# EAGLE design jusin_boad (EAGLE 6.2)
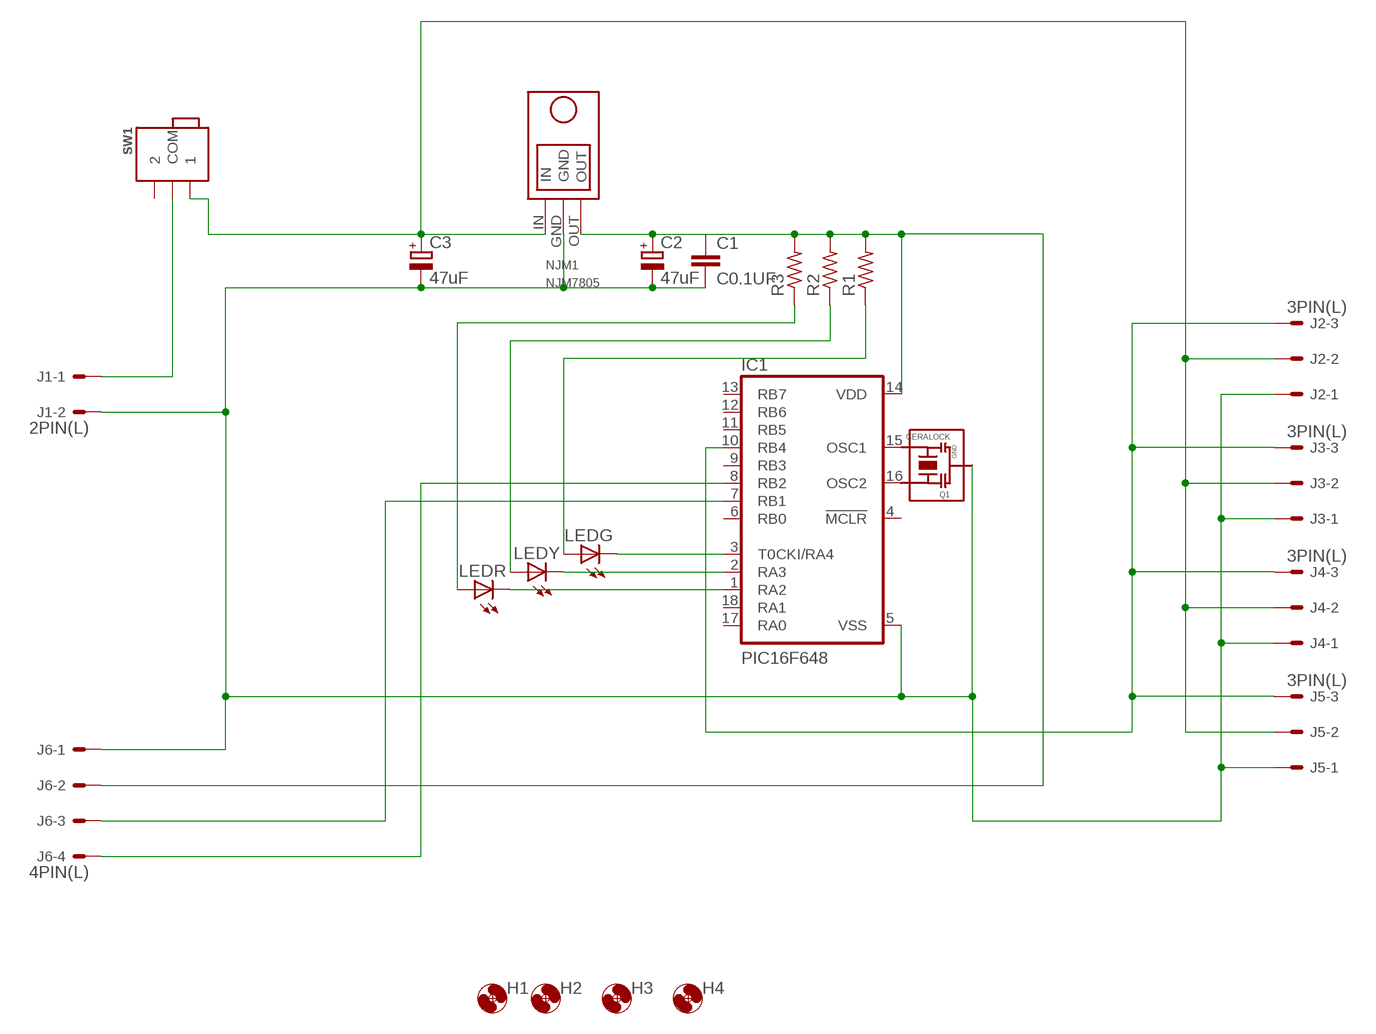
[diagram p0: schematic, sheet 1]

## Parts
C1  C0.1UF  [C0.1UF]
C2  47uF  C-ELEC  [C-6MM]
C3  47uF  C-ELEC  [C-6MM]
H1  HOLE3.3M3BOLT  [HOLE3.3]
H2  HOLE3.3M3BOLT  [HOLE3.3]
H3  HOLE3.3M3BOLT  [HOLE3.3]
H4  HOLE3.3M3BOLT  [HOLE3.3]
IC1  PIC16F648  [DIL18]
J1  2PIN(L)  [2PL]
J2  3PIN(L)  [3PL]
J3  3PIN(L)  [3PL]
J4  3PIN(L)  [3PL]
J5  3PIN(L)  [3PL]
J6  4PIN(L)  [4PL]
LEDG  LED  [LED5MM]
LEDR  LED  [LED5MM]
LEDY  LED  [LED5MM]
NJM1  NJM7805  [NJM7805]
Q1  CERALOCK  [CERALOCK]
R1  R-  [0207/10]
R2  R-  [0207/10]
R3  R-  [0207/10]
SW1  SWITCH_MININORMAL  [SWITCH_MINI]

## Nets
N$1: IC1.16(OSC2) Q1.P$1
N$2: IC1.15(OSC1) Q1.P$3
N$3: J1.1 SW1.COM
N$4: C3.+ J2.2 J3.2 J4.2 J5.2 NJM1.IN SW1.1
N$5: C1.2 C2.- C3.- IC1.5(VSS) J1.2 J2.1 J3.1 J4.1 J5.1 J6.1 NJM1.GND Q1.P$2
N$6: C1.1 C2.+ IC1.14(VDD) J6.2 NJM1.OUT R1.2 R2.2 R3.2
N$7: IC1.10(RB4) J2.3 J3.3 J4.3 J5.3
N$8: LEDR.A R3.1
N$9: LEDG.A R1.1
N$10: LEDY.A R2.1
N$11: IC1.3(T0CKI/RA4) LEDG.K(C)
N$12: IC1.2(RA3) LEDY.K(C)
N$13: IC1.1(RA2) LEDR.K(C)
N$15: IC1.7(RB1) J6.3
N$16: IC1.8(RB2) J6.4
Unconnected: IC1.4(!MCLR) IC1.6(RB0) IC1.9(RB3) IC1.11(RB5) IC1.12(RB6) IC1.13(RB7) IC1.17(RA0) IC1.18(RA1) SW1.2

## Library data of the parts
C1 = FP-21T for MITS:C0.1UF
C2 C3 = My_rcl:C-ELEC
H1-H4 = FP-21T for MITS:HOLE3.3
IC1 = FP-21T for MITS:PIC16F648
J1 = my_connector:2PIN(L)
J2-J5 = my_connector:3PIN(L)
J6 = my_connector:4PIN(L)
LEDG LEDR LEDY = my_led:LED: LED
NJM1 = My_NJM7805:NJM7805
Q1 = FP-21T for MITS:CERALOCK: CERALOCK CERAMIC RESONATOR
R1-R3 = My_rcl:R-: Resistor
SW1 = FP-21T for MITS:SWITCH_MINI: Switch 5.08mm

## Board
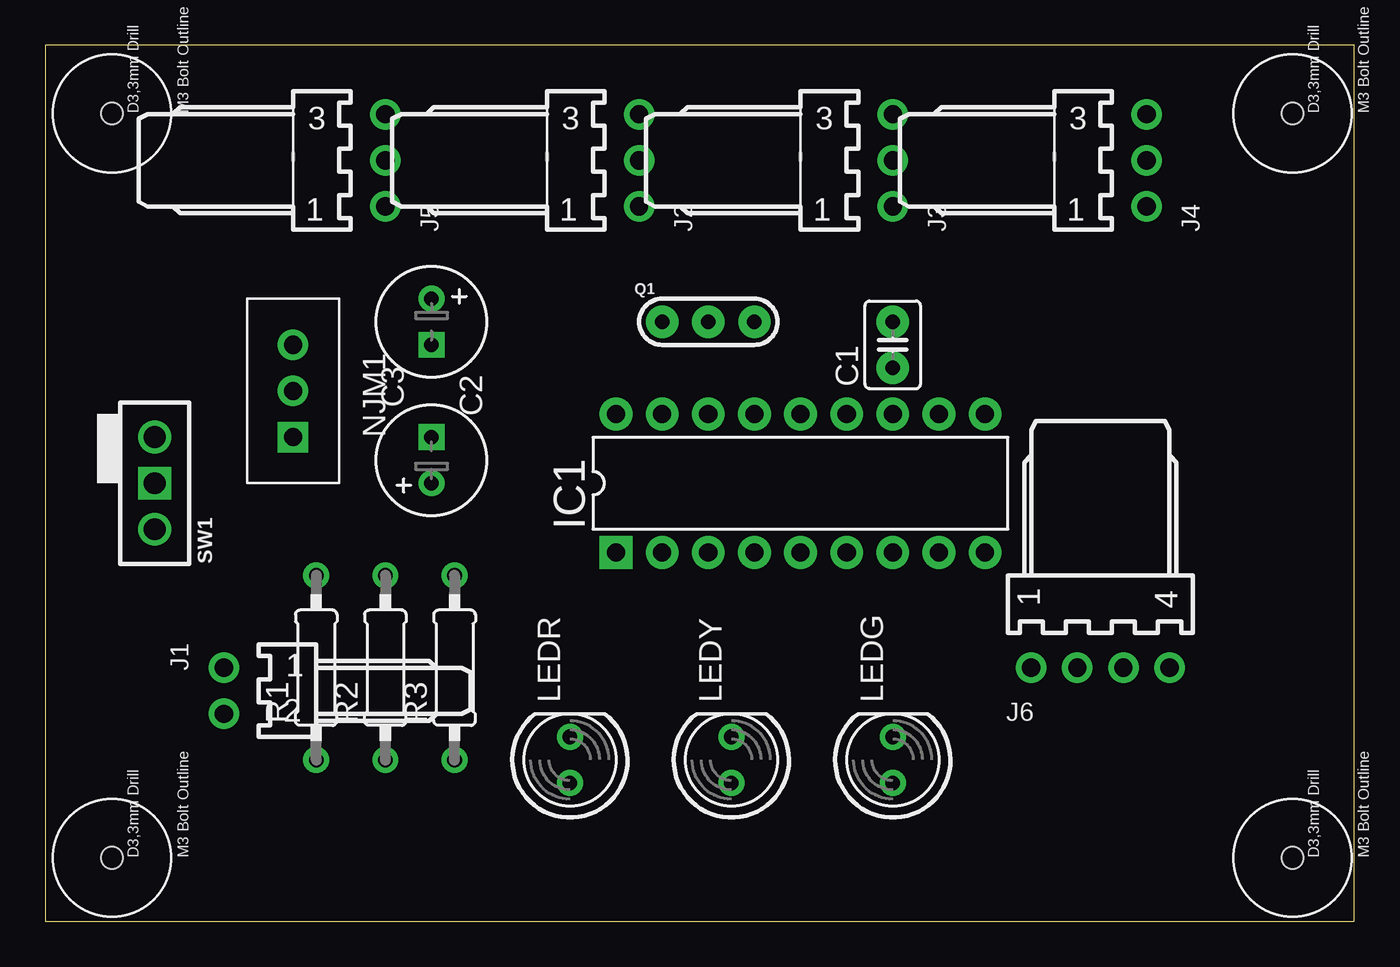
[diagram p1: board, top side]
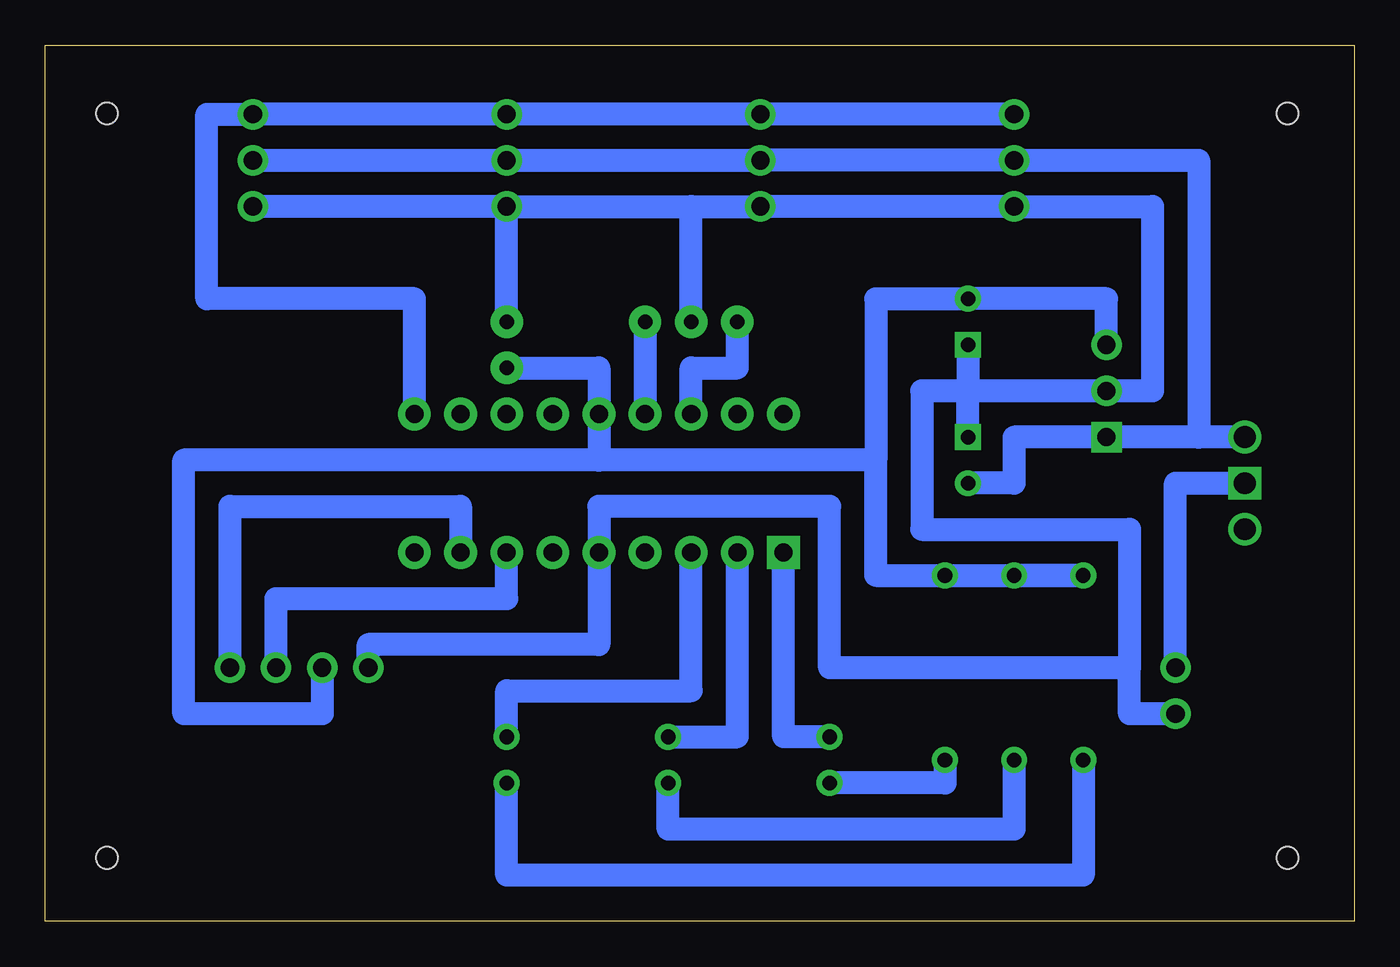
[diagram p2: board, bottom side, seen from below]

Size 72.06 x 48.24 mm. Coordinates in mm from the lower left corner, seen from the top.
Outline: 72.06,0 72.06,48.24 0,48.24 0,0 72.06,0
Copper layers (1*16): Top 0.035mm / dielectric 1.5mm / Bottom 0.035mm
Design rules: minimum track width 0.15mm, minimum drill 0.3mm, track to track 0.15mm, track to pad 0.15mm, pad to pad 0.15mm, via to via 0.15mm, smd to smd 0.15mm, copper to edge 0.7mm, drill to drill 0.45mm, minimum pad ring 0.15mm, minimum via ring 0.15mm, stop-mask expansion 4mil, vias tented up to drill 0mil, thermal gap 0.15mm

### Footprints (pad centres in the part's own frame; a part is rotated, then mirrored left to right if it is on the bottom)
C0.1UF = drill 0.8 pad 1.778: 1 -1.27,0; 2 1.27,0
C-6MM = drill 0.8 pad 1.422: + -1.27,0 | drill 0.8 pad 1.422 square: - 1.27,0
HOLE3.3 = hole 1.2: 0,0
DIL18 = drill 1 pad 1.8 square: 1 -10.16,-3.81 | drill 1 pad 1.8: 2 -7.62,-3.81; 3 -5.08,-3.81; 4 -2.54,-3.81; 5 0,-3.81; 6 2.54,-3.81; 7 5.08,-3.81; 8 7.62,-3.81; 9 10.16,-3.81; 10 10.16,3.81; 11 7.62,3.81; 12 5.08,3.81; 13 2.54,3.81; 14 0,3.81; 15 -2.54,3.81; 16 -5.08,3.81; 17 -7.62,3.81; 18 -10.16,3.81
2PL = drill 1 pad 1.676: 1 1.27,3.81; 2 -1.27,3.81
3PL = drill 1 pad 1.676: 1 2.54,3.81; 2 0,3.81; 3 -2.54,3.81
4PL = drill 1 pad 1.676: 1 3.81,3.81; 2 1.27,3.81; 3 -1.27,3.81; 4 -3.81,3.81
LED5MM = drill 0.8 pad 1.422: A -1.27,0; K 1.27,0
NJM7805 = drill 1 pad 1.676: GND 0,0; OUT 2.54,0 | drill 1 pad 1.676 square: IN -2.54,0
CERALOCK = drill 0.8 pad 1.778: P$1 -2.54,0; P$2 0,0; P$3 2.54,0
0207/10 = drill 0.8 pad 1.422: 1 -5.08,0; 2 5.08,0
SWITCH_MINI = drill 1.2 pad 1.8: 1 0,2.54; 2 0,-2.54 | drill 1.2 pad 1.8 square: COM 0,0

### Placement (x,y rotation side)
C1  46.66,31.75 90 top
C2  21.26,33.02 270 top
C3  21.26,25.4 90 top
H1  68.67,3.5 90 top
H2  3.67,3.5 90 top
H3  68.67,44.5 90 top
H4  3.67,44.5 90 top
IC1  41.58,24.13 0 top
J1  13.64,12.7 90 top
J2  28.88,41.91 270 top
J3  42.85,41.91 270 top
J4  56.82,41.91 270 top
J5  14.91,41.91 270 top
J6  58.09,17.78 180 top
LEDG  46.66,8.89 90 top
LEDR  28.88,8.89 90 top
LEDY  37.77,8.89 90 top
NJM1  13.64,29.21 90 top
Q1  36.5,33.02 0 top
R1  14.91,13.97 90 top
R2  18.72,13.97 90 top
R3  22.53,13.97 90 top
SW1  6.02,24.13 0 top

### Tracks (layer width: path | path; a pad name or v marks a point on that pad's centre or on a via)
N$1
  Bottom 1.27: IC1.16 36.5,30.48 33.96,30.48 Q1.P$1
N$2
  Bottom 1.27: Q1.P$3 IC1.15
N$3
  Bottom 1.27: J1.1 9.83,24.13 SW1.COM
N$4
  Bottom 1.27: J4.2 J3.2 J2.2 J5.2 8.56,41.91 8.56,26.67 | C3.+ 18.72,24.13 18.72,26.67 NJM1.IN 8.56,26.67 | SW1.1 8.56,26.67
N$5
  Bottom 1.27: J3.1 36.5,39.37 | 36.5,39.37 J2.1 J5.1 11.1,39.37 11.1,29.21 NJM1.GND 21.26,29.21 | J3.1 J4.1 | J6.1 54.28,15.24 41.58,15.24 IC1.5 41.58,22.86 28.88,22.86 28.88,13.97 12.37,13.97 | J1.2 12.37,11.43 12.37,13.97 | Q1.P$2 36.5,39.37 | 21.26,29.21 23.8,29.21 23.8,21.59 12.37,21.59 12.37,13.97 | C3.- 21.26,29.21 | C2.- 21.26,29.21 | C1.2 J3.1
N$6
  Bottom 1.27: R2.2 R1.2 R3.2 26.34,19.05 26.34,25.4 | NJM1.OUT 13.64,34.29 C2.+ 26.34,34.29 26.34,25.4 | C1.1 41.58,30.48 IC1.14 41.58,25.4 | J6.2 56.82,11.43 64.44,11.43 64.44,25.4 41.58,25.4 | 26.34,25.4 41.58,25.4
N$7
  Bottom 1.27: J5.3 J2.3 J3.3 J4.3 63.17,44.45 63.17,34.29 51.74,34.29 IC1.10
N$8
  Bottom 1.27: R3.1 22.53,7.62 LEDR.A
N$9
  Bottom 1.27: R1.1 14.91,2.54 46.66,2.54 LEDG.A
N$10
  Bottom 1.27: R2.1 18.72,5.08 37.77,5.08 LEDY.A
N$11
  Bottom 1.27: LEDG.K 46.66,12.7 36.5,12.7 IC1.3
N$12
  Bottom 1.27: LEDY.K 33.96,10.16 IC1.2
N$13
  Bottom 1.27: LEDR.K 31.42,10.16 IC1.1
N$15
  Bottom 1.27: J6.3 59.36,17.78 46.66,17.78 IC1.7
N$16
  Bottom 1.27: J6.4 61.9,22.86 49.2,22.86 IC1.8